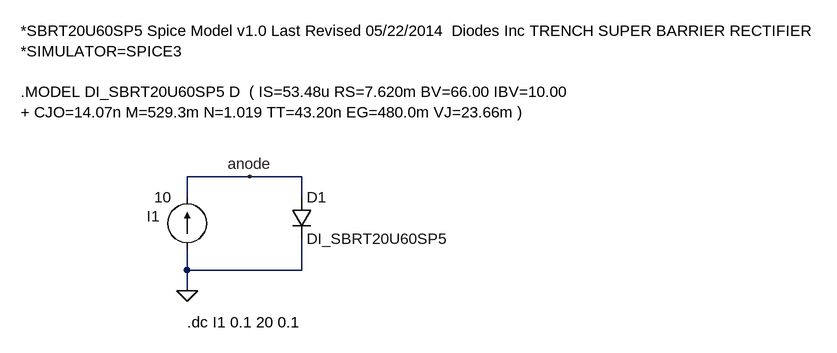
[diagram p0: schematic 03-sbrt20u60sp5.asc]
03-sbrt20u60sp5.asc, the LTspice schematic file:
Version 4
SHEET 1 1556 680
WIRE 320 96 224 96
WIRE 400 96 320 96
WIRE 224 128 224 96
WIRE 400 128 400 96
WIRE 224 240 224 208
WIRE 400 240 400 192
WIRE 400 240 224 240
WIRE 224 272 224 240
FLAG 224 272 0
FLAG 320 96 anode
SYMBOL diode 384 128 R0
SYMATTR InstName D1
SYMATTR Value DI_SBRT20U60SP5
SYMBOL current 224 208 R180
WINDOW 0 42 51 Left 2
WINDOW 123 0 0 Left 0
WINDOW 39 0 0 Left 0
SYMATTR InstName I1
SYMATTR Value 10
TEXT -32 -128 Left 2 !*SBRT20U60SP5 Spice Model v1.0 Last Revised 05/22/2014  Diodes Inc TRENCH SUPER BARRIER RECTIFIER\n*SIMULATOR=SPICE3\n \n.MODEL DI_SBRT20U60SP5 D  ( IS=53.48u RS=7.620m BV=66.00 IBV=10.00\n+ CJO=14.07n M=529.3m N=1.019 TT=43.20n EG=480.0m VJ=23.66m )
TEXT 224 320 Left 2 !.dc I1 0.1 20 0.1

The netlist it stands for:
* 03-sbrt20u60sp5.asc
D1 anode 0 DI_SBRT20U60SP5
I1 0 anode 10
.model D D
.lib standard.dio
*SBRT20U60SP5 Spice Model v1.0 Last Revised 05/22/2014  Diodes Inc TRENCH SUPER BARRIER RECTIFIER
*SIMULATOR=SPICE3
.MODEL DI_SBRT20U60SP5 D  ( IS=53.48u RS=7.620m BV=66.00 IBV=10.00
+ CJO=14.07n M=529.3m N=1.019 TT=43.20n EG=480.0m VJ=23.66m )
.dc I1 0.1 20 0.1
.backanno
.end